# Altium schematic sheet PROB_S7CAS_MOTDRIVER.SchDoc
size Tabloid; SheetNumber: 14; SheetTotal: 15; Sheet_Name: Contrôle du moteur; Size: 11x17
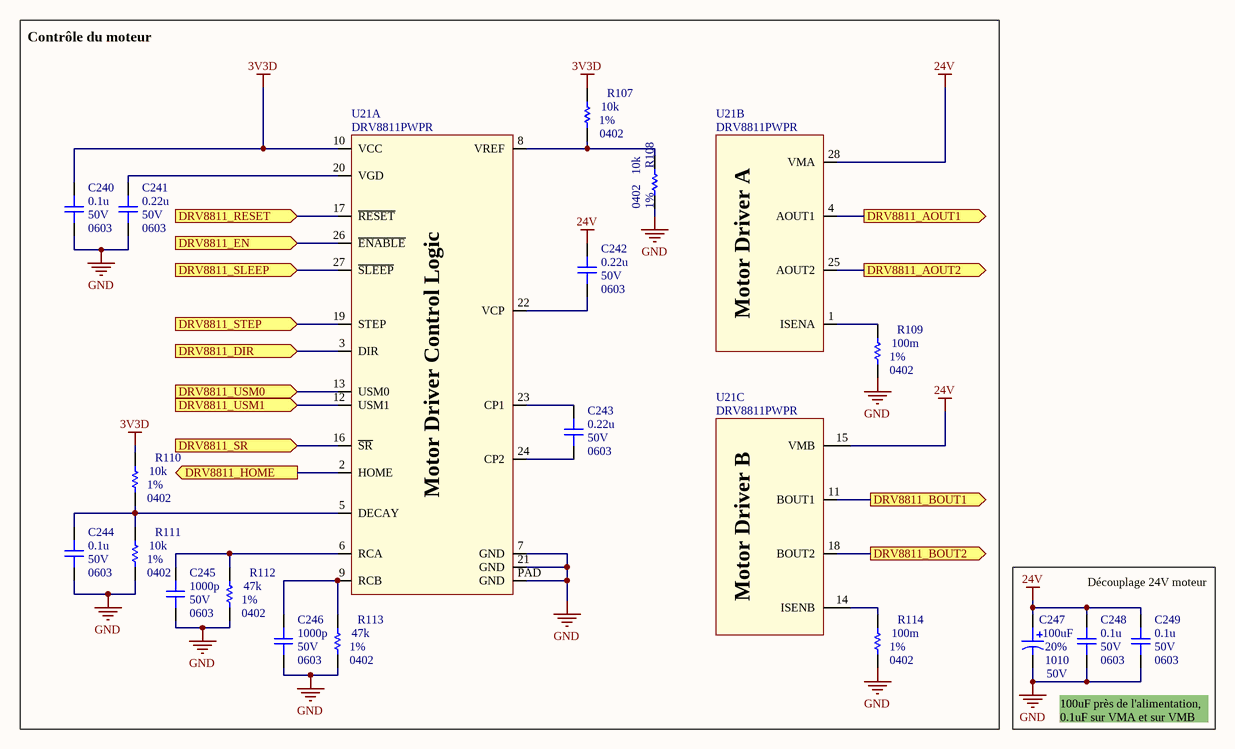
[diagram p0: PROB_S7CAS_MOTDRIVER.SchDoc]

## Parts
C240  value 0.1u  Voltage: 50V  Package: 0603  [CAP_0603]  (hidden comment: CAP - 0603)
C241  value 0.22u  Voltage: 50V  Package: 0603  [CAP_0603]  (hidden comment: CAP - 0603)
C242  value 0.22u  Voltage: 50V  Package: 0603  [CAP_0603]  (hidden comment: CAP - 0603)
C243  value 0.22u  Voltage: 50V  Package: 0603  [CAP_0603]  (hidden comment: CAP - 0603)
C244  value 0.1u  Voltage: 50V  Package: 0603  [CAP_0603]  (hidden comment: CAP - 0603)
C245  value 1000p  Voltage: 50V  Package: 0603  [CAP_0603]  (hidden comment: CAP - 0603)
C246  value 1000p  Voltage: 50V  Package: 0603  [CAP_0603]  (hidden comment: CAP - 0603)
C247  value 100uF  Voltage: 50V  Package: 1010  Precision: 20%  [CAP_ALU_1010_vishay]  (hidden comment: MAL215099101E3)
C248  value 0.1u  Voltage: 50V  Package: 0603  [CAP_0603]  (hidden comment: CAP - 0603)
C249  value 0.1u  Voltage: 50V  Package: 0603  [CAP_0603]  (hidden comment: CAP - 0603)
R107  value 10k  Package: 0402  Precision: 1%  [RES_0402]  (hidden comment: RES - 0402)
R108  value 10k  Package: 0402  Precision: 1%  [RES_0402]  (hidden comment: RES - 0402)
R109  value 100m  Package: 0402  Precision: 1%  [RES_0402]  (hidden comment: RES - 0402)
R110  value 10k  Package: 0402  Precision: 1%  [RES_0402]  (hidden comment: RES - 0402)
R111  value 10k  Package: 0402  Precision: 1%  [RES_0402]  (hidden comment: RES - 0402)
R112  value 47k  Package: 0402  Precision: 1%  [RES_0402]  (hidden comment: RES - 0402)
R113  value 47k  Package: 0402  Precision: 1%  [RES_0402]  (hidden comment: RES - 0402)
R114  value 100m  Package: 0402  Precision: 1%  [RES_0402]  (hidden comment: RES - 0402)
U21  DRV8811PWPR  [POW_MOTOR_DRV8811PWPR]  (parts A,B,C of 3)

## Ports
DRV8811_AOUT1 (out), DRV8811_AOUT2 (out), DRV8811_BOUT1 (out), DRV8811_BOUT2 (out), DRV8811_DIR (in), DRV8811_EN (in), DRV8811_HOME (out), DRV8811_RESET (in), DRV8811_SLEEP (in), DRV8811_SR (in), DRV8811_STEP (in), DRV8811_USM0 (in), DRV8811_USM1 (in)

## Nets
3V3D: C240.2 R107.2 R110.2 U21.10(VCC)
24V: C242.2 C247.1 C248.2 C249.2 U21.15(VMB) U21.28(VMA)
GND: C240.1 C241.1 C244.1 C245.1 C246.1 C247.2 C248.1 C249.1 R108.2 R109.1 R111.1 R112.1 R113.1 R114.1 U21.7(GND) U21.21(GND) U21.PAD(GND)
DRV8811_AOUT1: U21.4(AOUT1) ; port DRV8811_AOUT1
DRV8811_AOUT2: U21.25(AOUT2) ; port DRV8811_AOUT2
DRV8811_BOUT1: U21.11(BOUT1) ; port DRV8811_BOUT1
DRV8811_BOUT2: U21.18(BOUT2) ; port DRV8811_BOUT2
DRV8811_DIR: U21.3(DIR) ; port DRV8811_DIR
DRV8811_EN: U21.26(~{ENABLE}) ; port DRV8811_EN
DRV8811_HOME: U21.2(HOME) ; port DRV8811_HOME
DRV8811_RESET: U21.17(~{RESET}) ; port DRV8811_RESET
DRV8811_SLEEP: U21.27(~{SLEEP}) ; port DRV8811_SLEEP
DRV8811_SR: U21.16(~{SR}) ; port DRV8811_SR
DRV8811_STEP: U21.19(STEP) ; port DRV8811_STEP
DRV8811_USM0: U21.13(USM0) ; port DRV8811_USM0
DRV8811_USM1: U21.12(USM1) ; port DRV8811_USM1
NetC241_2: C241.2 U21.20(VGD)
NetC242_1: C242.1 U21.22(VCP)
NetC243_1: C243.1 U21.24(CP2)
NetC243_2: C243.2 U21.23(CP1)
NetC244_2: C244.2 R110.1 R111.2 U21.5(DECAY)
NetC245_2: C245.2 R112.2 U21.6(RCA)
NetC246_2: C246.2 R113.2 U21.9(RCB)
NetR107_1: R107.1 R108.1 U21.8(VREF)
NetR109_2: R109.2 U21.1(ISENA)
NetR114_2: R114.2 U21.14(ISENB)

## Notes on the sheet
- Contrôle du moteur
- Découplage 24V moteur
- 100uF près de l'alimentation, 0.1uF sur VMA et sur VMB
- Sheet Name
- Project Title
- Global Project
- Size
- Group
- Revision
- Date
- Sheet
- of
- Filename
- Designers
- (in symbol POW_MOTOR_DRV8811PWPR, part A) Motor Driver Control Logic
- (in symbol POW_MOTOR_DRV8811PWPR, part B) Motor Driver A
- (in symbol POW_MOTOR_DRV8811PWPR, part C) Motor Driver B

## Library data of the parts
C240-C246 C248 C249 = CAP - 0603: Precision: 10%; Current: *; CreatedBy: Jonathan Bouchard; Power: *
C247 = CAP_ALU_MAL215099101E3: CAP - ALU 100uF 20% 50V - 1010; Current: 490mA; Mfg: Vishay Dale; Mfg Part Number: MAL215099101E3; HelpURL: http://www.vishay.com/docs/28395/150crz.pdf; CreatedBy: Jonathan Bouchard; Temperature: -55°C to 125°C; Power: *; Supplier 1: Digikey; Supplier Part Number 1: 4399PHDKR-ND
R107-R114 = RES - 0402: Voltage: 50V; Power: 1/16W; Current: *; CreatedBy: Jonathan Bouchard
U21 = POW_MOTOR_DRV8811PWPR: POW - STEPPER MOTOR DRIVER - SOP-28; Voltage: 3 V ~ 5.5 V / 8 V ~ 38 V; Mfg: Texas Instrument; Current: *; Power: *; Mfg Part Number: DRV8811PWPR; HelpURL: http://www.ti.com/lit/ds/symlink/drv8811.pdf; CreatedBy: Jonathan Bouchard; Temperature: -40°C ~ 150°C (TJ); Value: *; Precision: *; Package: SOP-28; Supplier 1: Digikey; Supplier Part Number 1: 296-24591-1-ND